# EAGLE schematic CEM3360-VCA-IO (EAGLE 9.6.2)
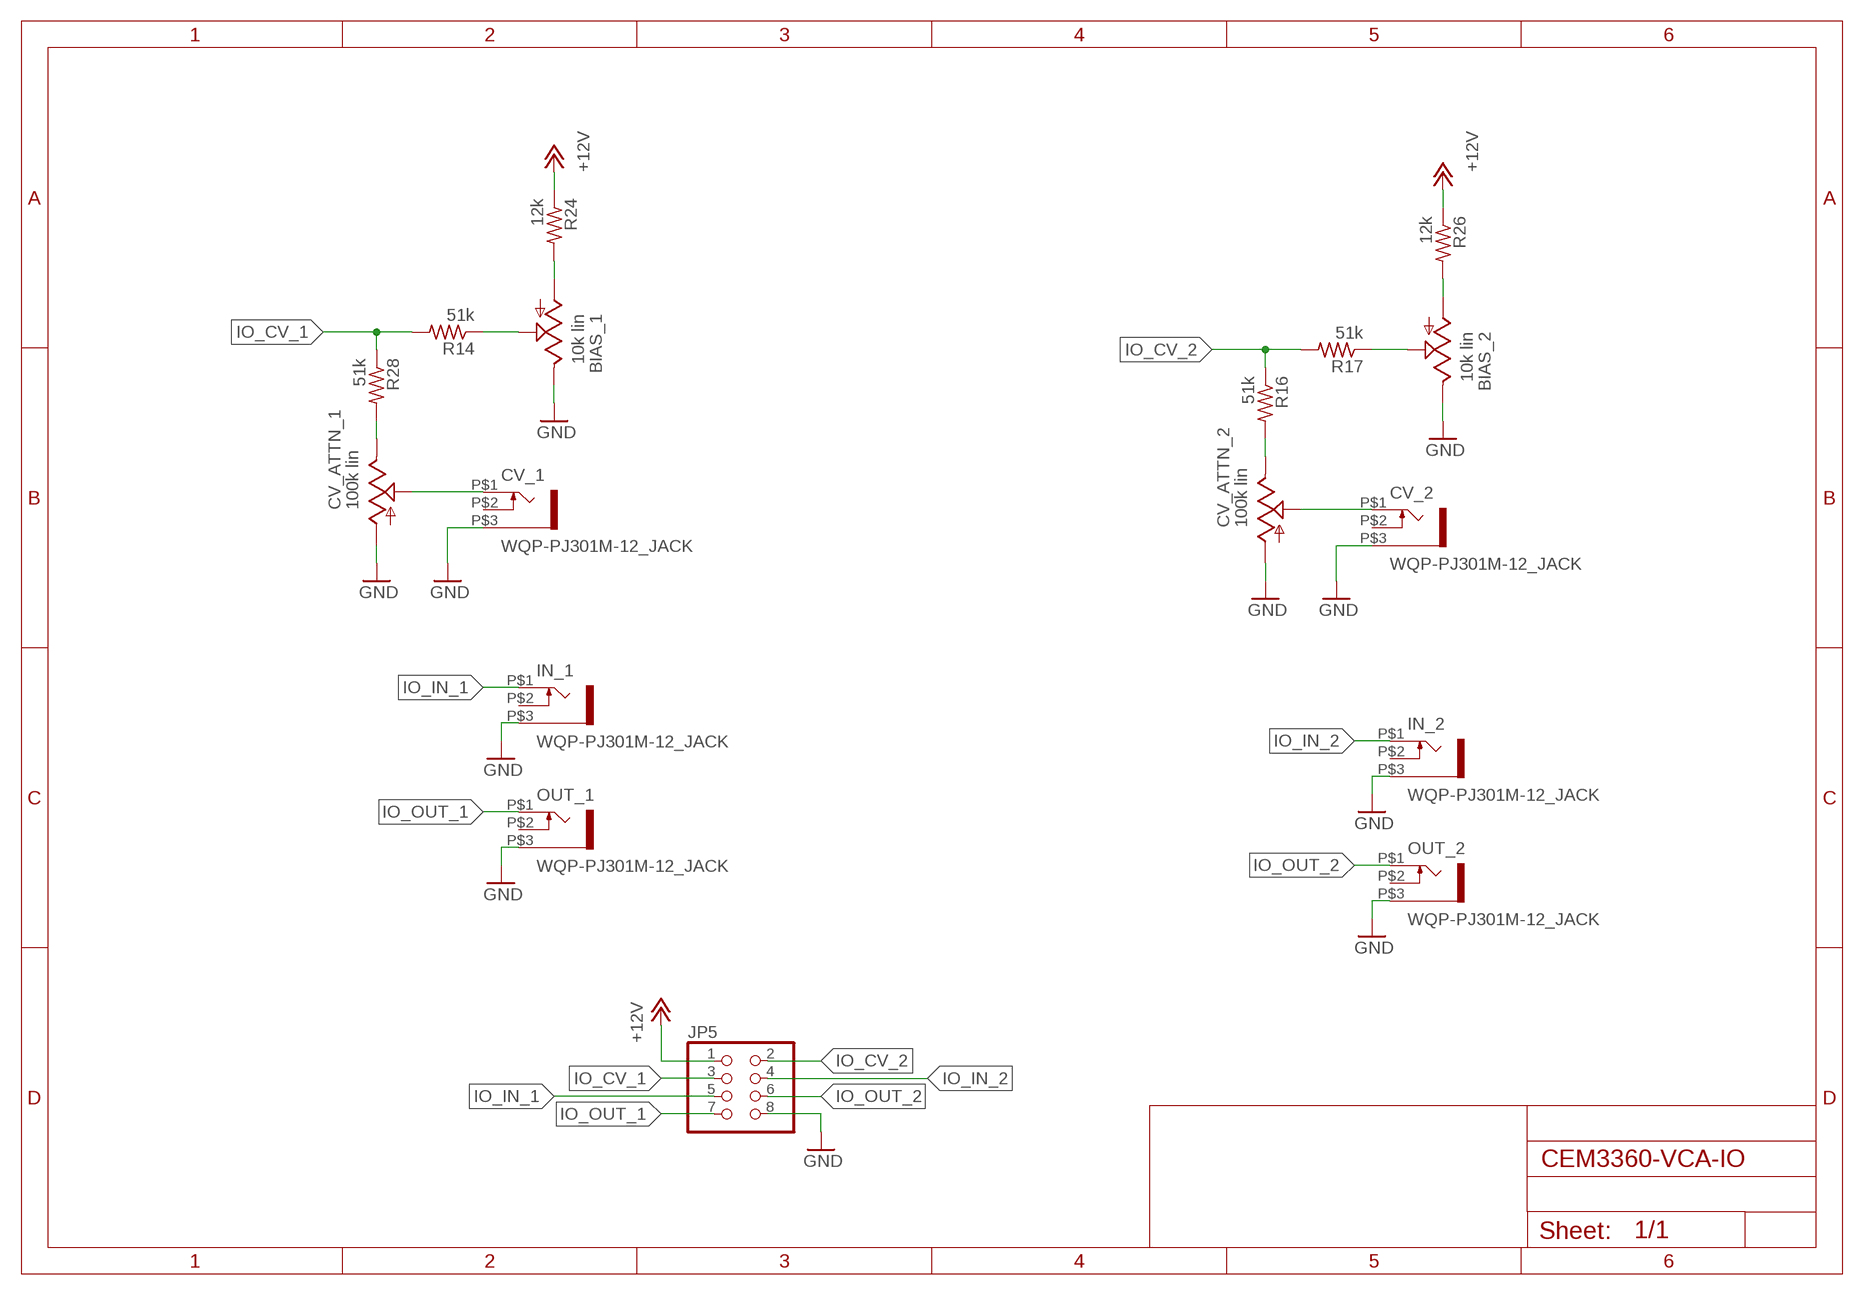
[diagram p0: schematic, sheet 1]

## Parts
BIAS_1  10k lin  ALPHA-9MMA  [EVUF]
BIAS_2  10k lin  ALPHA-9MMA  [EVUF]
CV_1  WQP-PJ301M-12_JACK  [WQP-PJ301M-12_JACK]
CV_2  WQP-PJ301M-12_JACK  [WQP-PJ301M-12_JACK]
CV_ATTN_1  100k lin  ALPHA-9MMA  [EVUF]
CV_ATTN_2  100k lin  ALPHA-9MMA  [EVUF]
IN_1  WQP-PJ301M-12_JACK  [WQP-PJ301M-12_JACK]
IN_2  WQP-PJ301M-12_JACK  [WQP-PJ301M-12_JACK]
JP5  PINHD-2X4  [2X04]
OUT_1  WQP-PJ301M-12_JACK  [WQP-PJ301M-12_JACK]
OUT_2  WQP-PJ301M-12_JACK  [WQP-PJ301M-12_JACK]
R14  51k  R-US_0207/7  [0207/7]
R16  51k  R-US_0207/7  [0207/7]
R17  51k  R-US_0207/7  [0207/7]
R24  12k  R-US_0207/7  [0207/7]
R26  12k  R-US_0207/7  [0207/7]
R28  51k  R-US_0207/7  [0207/7]

## Nets
+12V: JP5.1 R24.1 R26.1
GND: BIAS_1.3(E) BIAS_2.3(E) CV_1.P$3 CV_2.P$3 CV_ATTN_1.1(A) CV_ATTN_2.1(A) IN_1.P$3 IN_2.P$3 JP5.8 OUT_1.P$3 OUT_2.P$3
IO_CV_1: JP5.3 R14.2 R28.1
IO_CV_2: JP5.2 R16.1 R17.2
IO_IN_1: IN_1.P$1 JP5.5
IO_IN_2: IN_2.P$1 JP5.4
IO_OUT_1: JP5.7 OUT_1.P$1
IO_OUT_2: JP5.6 OUT_2.P$1
N$4: CV_ATTN_1.3(E) R28.2
N$13: BIAS_1.2(S) R14.1
N$15: BIAS_1.1(A) R24.2
N$17: CV_1.P$1 CV_ATTN_1.2(S)
N$18: CV_ATTN_2.3(E) R16.2
N$19: CV_2.P$1 CV_ATTN_2.2(S)
N$20: BIAS_2.2(S) R17.1
N$22: BIAS_2.1(A) R26.2
Unconnected: CV_1.P$2 CV_2.P$2 IN_1.P$2 IN_2.P$2 OUT_1.P$2 OUT_2.P$2

## Library data of the parts
BIAS_1 BIAS_2 CV_ATTN_1 CV_ATTN_2 = TomW:ALPHA-9MM: 9 mm Square Rotary Potentiometers Source: Panasonic
CV_1 CV_2 IN_1 IN_2 OUT_1 OUT_2 = thonkiconn:WQP-PJ301M-12_JACK
JP5 = pinhead:PINHD-2X4: PIN HEADER
R14 R16 R17 R24 R26 R28 = resistor:R-US_: RESISTOR, American symbol